# EAGLE design Pi_grammer_MAIN (EAGLE 6.5.0)
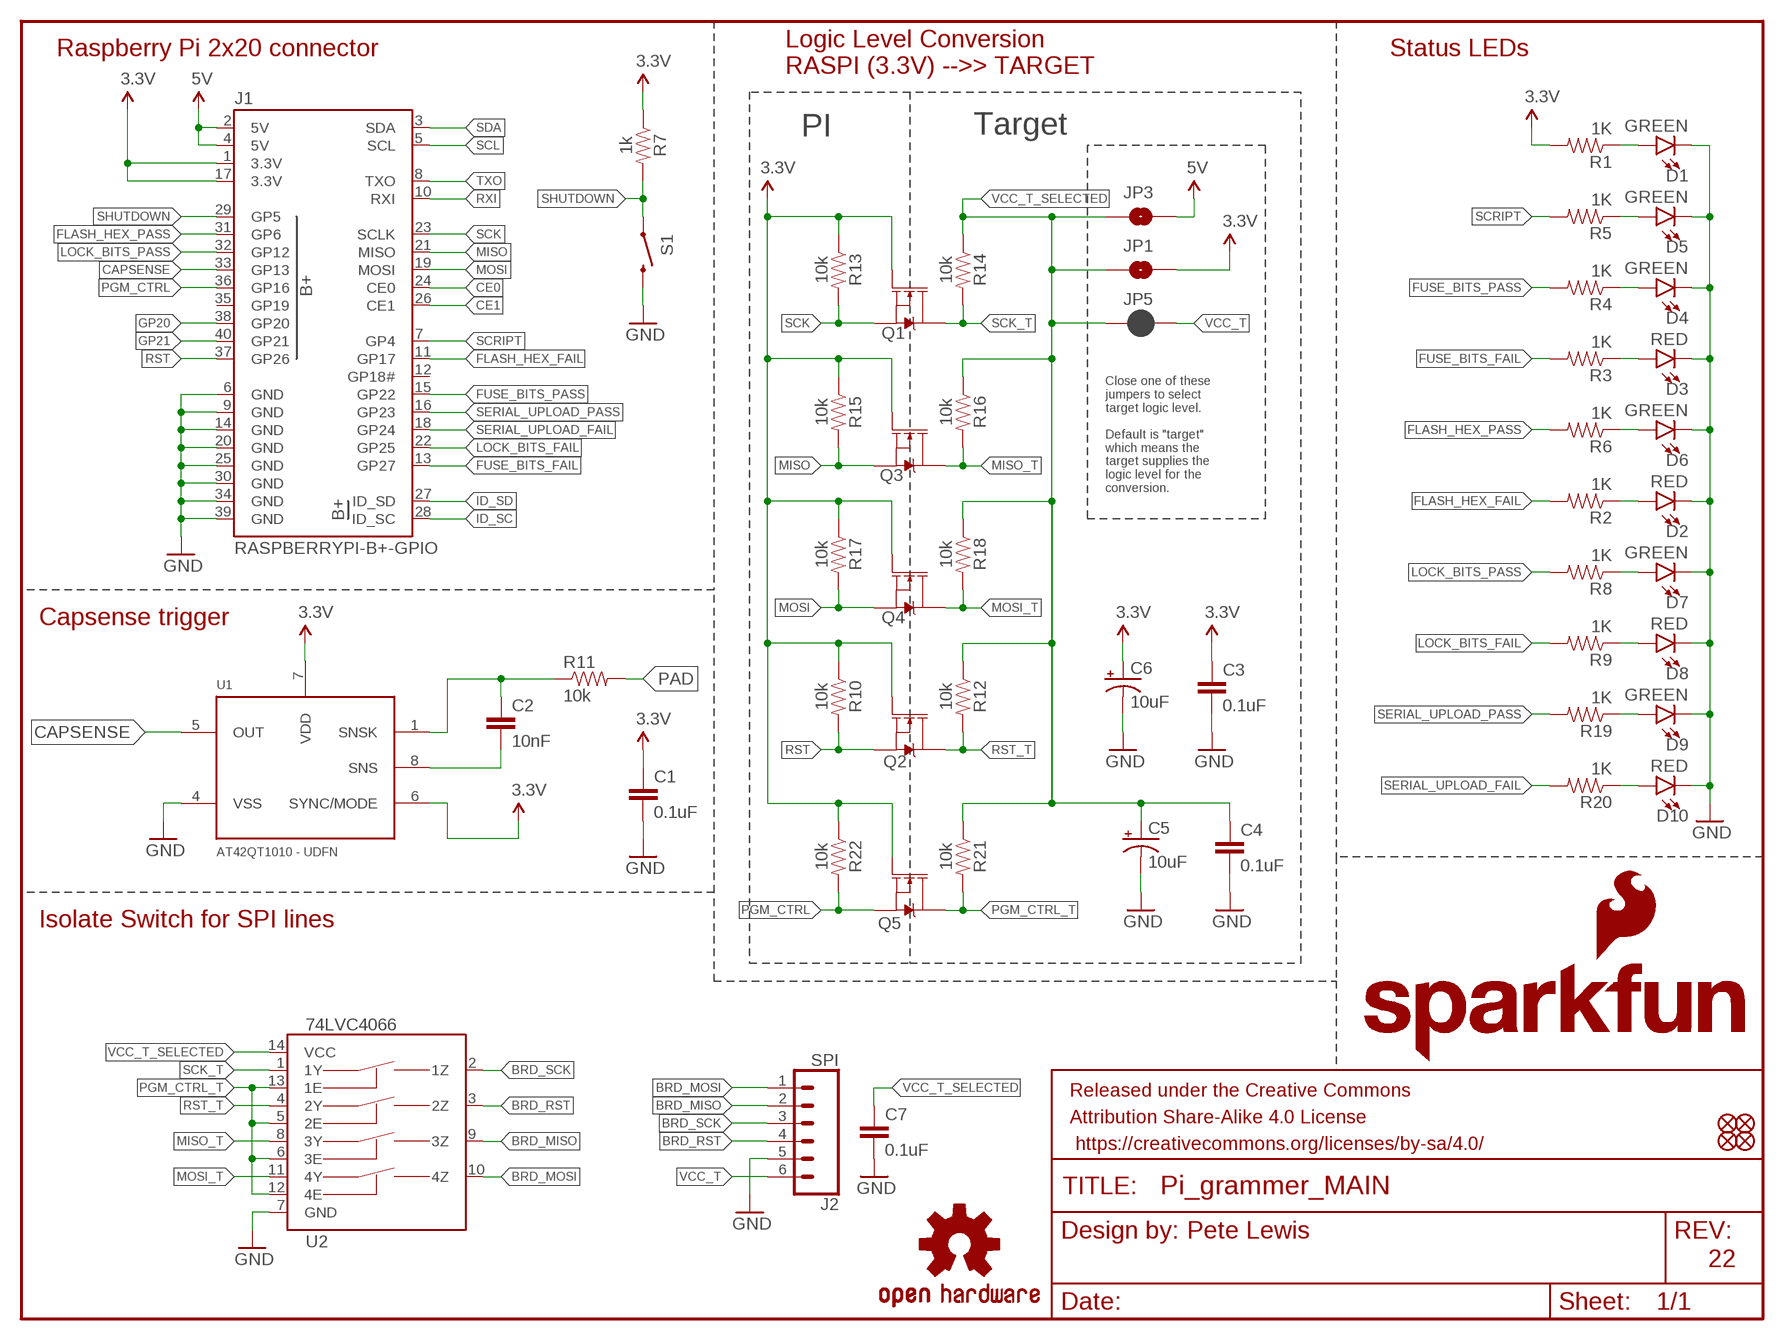
[diagram p0: schematic, sheet 1]

## Parts
C1  0.1uF  0.1UF-25V(+80/-20%)(0603)  [0603-CAP]
C2  10nF  10NF/10000PF-50V-10%(0603)  [0603-CAP]
C3  0.1uF  0.1UF-0603-25V-(+80/-20%)  [0603]
C4  0.1uF  0.1UF-0603-25V-(+80/-20%)  [0603]
C5  10uF  10UF-POLAR-EIA3216-16V-10%(TANT)  [EIA3216]
C6  10uF  10UF-POLAR-EIA3216-16V-10%(TANT)  [EIA3216]
C7  0.1uF  0.1UF-0603-25V-(+80/-20%)  [0603]
D1  GREEN  LED-GREEN1206  [LED-1206]
D2  RED  LED-RED1206  [LED-1206]
D3  RED  LED-RED1206  [LED-1206]
D4  GREEN  LED-GREEN1206  [LED-1206]
D5  GREEN  LED-GREEN1206  [LED-1206]
D6  GREEN  LED-GREEN1206  [LED-1206]
D7  GREEN  LED-GREEN1206  [LED-1206]
D8  RED  LED-RED1206  [LED-1206]
D9  GREEN  LED-GREEN1206  [LED-1206]
D10  RED  LED-RED1206  [LED-1206]
FD1  FIDUCIALUFIDUCIAL  [FIDUCIAL-MICRO]
FD2  FIDUCIALUFIDUCIAL  [FIDUCIAL-MICRO]
FD3  FIDUCIALUFIDUCIAL  [FIDUCIAL-MICRO]
FD4  FIDUCIALUFIDUCIAL  [FIDUCIAL-MICRO]
FRAME1  FRAME-LETTER  [CREATIVE_COMMONS]
J1  RASPBERRYPI-B+-GPIO  [2X20-SHROUDED]
J2  SPI  CONN_06SMD  [1X06-SMD_RA_MALE]
JP1  JUMPER-SMT_2_NO_SILK  [SMT-JUMPER_2_NO_SILK]
JP3  JUMPER-SMT_2_NO_SILK  [SMT-JUMPER_2_NO_SILK]
JP5  JUMPER-SMT_2_NC_PASTE_SILK  [SMT-JUMPER_2_NC_PASTE_SILK]
LOGO1  SFE_LOGO_FLAME.2_INCH  [SFE_LOGO_FLAME_.2]
LOGO2  OSHW-LOGOL  [OSHW-LOGO-L]
LOGO3  SFE_LOGO_NAME.6_INCH  [SFE_LOGO_NAME_.6]
Q1  220mA/50V/3.5Ω  MOSFET-NCH-BSS138  [SOT23-3]
Q2  220mA/50V/3.5Ω  MOSFET-NCH-BSS138  [SOT23-3]
Q3  220mA/50V/3.5Ω  MOSFET-NCH-BSS138  [SOT23-3]
Q4  220mA/50V/3.5Ω  MOSFET-NCH-BSS138  [SOT23-3]
Q5  220mA/50V/3.5Ω  MOSFET-NCH-BSS138  [SOT23-3]
R1  1K  1KOHM-1/10W-1%(0603)  [0603-RES]
R2  1K  1KOHM-1/10W-1%(0603)  [0603-RES]
R3  1K  1KOHM-1/10W-1%(0603)  [0603-RES]
R4  1K  1KOHM-1/10W-1%(0603)  [0603-RES]
R5  1K  1KOHM-1/10W-1%(0603)  [0603-RES]
R6  1K  1KOHM-1/10W-1%(0603)  [0603-RES]
R7  1k  1KOHM-0603-1/10W-1%  [0603]
R8  1K  1KOHM-1/10W-1%(0603)  [0603-RES]
R9  1K  1KOHM-1/10W-1%(0603)  [0603-RES]
R10  10k  10KOHM-0603-1/10W-1%  [0603]
R11  10k  10KOHM-1/10W-1%(0603)0603  [0603-RES]
R12  10k  10KOHM-0603-1/10W-1%  [0603]
R13  10k  10KOHM-0603-1/10W-1%  [0603]
R14  10k  10KOHM-0603-1/10W-1%  [0603]
R15  10k  10KOHM-0603-1/10W-1%  [0603]
R16  10k  10KOHM-0603-1/10W-1%  [0603]
R17  10k  10KOHM-0603-1/10W-1%  [0603]
R18  10k  10KOHM-0603-1/10W-1%  [0603]
R19  1K  1KOHM-1/10W-1%(0603)  [0603-RES]
R20  1K  1KOHM-1/10W-1%(0603)  [0603-RES]
R21  10k  10KOHM-0603-1/10W-1%  [0603]
R22  10k  10KOHM-0603-1/10W-1%  [0603]
S1  SWITCH-MOMENTARY-2SMD  [TACTILE-SWITCH-SMD]
U1  AT42QT1010 - UDFN  AT42QT1010UDFN  [UDFN/USON_8_PAD]
U2  74LVC4066  74LVC4066D_QUAD_BILATERAL_SWITCH  [SO14]

## Nets
3.3V: C1.1 C3.1 C6.+ J1.1(3.3V) J1.17(3.3V) JP1.2 Q1.1(G) Q2.1(G) Q3.1(G) Q4.1(G) Q5.1(G) R1.2 R7.1 R10.1 R13.1 R15.1 R17.1 R22.1 U1.6(SYNC/MODE) U1.7(VDD)
5V: J1.2(5V) J1.4(5V) JP3.2
BRD_MISO: J2.2 U2.9(3Z)
BRD_MOSI: J2.1 U2.10(4Z)
BRD_RST: J2.4 U2.3(2Z)
BRD_SCK: J2.3 U2.2(1Z)
CAPSENSE: J1.33(GP13) U1.5(OUT)
CE0: J1.24(CE0)
CE1: J1.26(CE1)
FLASH_HEX_FAIL: J1.11(GP17) R2.2
FLASH_HEX_PASS: J1.31(GP6) R6.2
FUSE_BITS_FAIL: J1.13(GP27) R3.2
FUSE_BITS_PASS: J1.15(GP22) R4.2
GND: C1.2 C3.2 C4.2 C5.- C6.- C7.2 D1.C D2.C D3.C D4.C D5.C D6.C D7.C D8.C D9.C D10.C J1.6(GND) J1.9(GND) J1.14(GND) J1.20(GND) J1.25(GND) J1.30(GND) J1.34(GND) J1.39(GND) J2.5 S1.3 U1.4(VSS) U2.7(GND)
GP20: J1.38(GP20)
GP21: J1.40(GP21)
ID_SC: J1.28(ID_SC)
ID_SD: J1.27(ID_SD)
LOCK_BITS_FAIL: J1.22(GP25) R9.2
LOCK_BITS_PASS: J1.32(GP12) R8.2
MISO: J1.21(MISO) Q3.2(S) R15.2
MISO_T: Q3.3(D) R16.2 U2.8(3Y)
MOSI: J1.19(MOSI) Q4.2(S) R17.2
MOSI_T: Q4.3(D) R18.2 U2.11(4Y)
N$1: D6.A R6.1
N$2: D1.A R1.1
N$3: D2.A R2.1
N$4: D3.A R3.1
N$5: D7.A R8.1
N$6: D4.A R4.1
N$7: D5.A R5.1
N$8: D8.A R9.1
N$10: C2.2 U1.8(SNS)
N$11: C2.1 R11.1 U1.1(SNSK)
N$13: D9.A R19.1
N$14: D10.A R20.1
PAD: R11.2
PGM_CTRL: J1.36(GP16) Q5.2(S) R22.2
PGM_CTRL_T: Q5.3(D) R21.2 U2.5(2E) U2.6(3E) U2.12(4E) U2.13(1E)
RST: J1.37(GP26) Q2.2(S) R10.2
RST_T: Q2.3(D) R12.2 U2.4(2Y)
RXI: J1.10(RXI)
SCK: J1.23(SCLK) Q1.2(S) R13.2
SCK_T: Q1.3(D) R14.2 U2.1(1Y)
SCL: J1.5(SCL)
SCRIPT: J1.7(GP4) R5.2
SDA: J1.3(SDA)
SERIAL_UPLOAD_FAIL: J1.18(GP24) R20.2
SERIAL_UPLOAD_PASS: J1.16(GP23) R19.2
SHUTDOWN: J1.29(GP5) R7.2 S1.1
TXO: J1.8(TXO)
VCC_T: J2.6 JP5.2
VCC_T_SELECTED: C4.1 C5.+ C7.1 JP1.1 JP3.1 JP5.1 R12.1 R14.1 R16.1 R18.1 R21.1 U2.14(VCC)
Unconnected: J1.12(GP18#) J1.35(GP19)

## Notes on the sheet
- Raspberry Pi 2x20 connector | Status LEDs
- Logic Level Conversion
  RASPI (3.3V) -->> TARGET
- PI | Target
- Close one of these 
  jumpers to select 
  target logic level. 
  
  Default is "target"
  which means the 
  target supplies the 
  logic level for the 
  conversion.
- Capsense trigger
- Isolate Switch for SPI lines
- Pete Lewis
- 22

## Library data of the parts
C1 = SparkFun-Capacitors:0.1UF-25V(+80/-20%)(0603): CAP-00810 Ceramic Standard decoupling cap; PROD_ID: CAP-00810
C2 = SparkFun-Capacitors:10NF/10000PF-50V-10%(0603): CAP-00867; PROD_ID: CAP-00867
C3 C4 C7 = SparkFun-Capacitors:0.1UF: 0.1µF ceramic capacitors A capacitor is a passive two-terminal electrical component used to store electrical energy temporarily in an electric field.; PROD_ID: CAP-00810
C5 C6 = SparkFun-Capacitors:10UF-POLAR: 10.0µF polarized capacitors A capacitor is a passive two-terminal electrical component used to store electrical energy temporarily in an electric field.; PROD_ID: CAP-00811
D1 D4-D7 D9 = SparkFun-LED:LED-GREEN: Green SMD LED Used in manufacturing of various products at SparkFun Packages: 0603 - SMD 0603 package [Product Link] <http://www.futureelectronics.com/en/technologies/semiconductors/optoelectronics/leds/Pages/9894312-LTST-C190GKT.aspx?CrossPart=HSMG-C190&IM=0> LilyPad 1206 - SMD1206 LilyPad package [Product Link] <http://www.futureelectronics.com/en/Technologies/Product.aspx?ProductID=IN150NGHARVATEKCORPORATION2049943&IM=0> 1206 - SMD1206 package [Product Link] <http://www.futureelectronics.com/en/technologies/semiconductors/optoelectronics/leds/Pages/8315665-LTST-C150KGKT.aspx?IM=0> 1206 Bottom Mount -SMD 1206 Bottom Mount [Product Link] <http://www.digikey.com/product-detail/en/lite-on-inc/LTST-C230KGKT/160-1456-1-ND/386854> SparkFun Products: Pro Mini 328 -5V <https://www.sparkfun.com/products/821> RedBoard <https://www.sparkfun.com/products/12757> MP3 Trigger <https://www.sparkfun.com/products/13720> Makey Makey <https://www.sparkfun.com/products/11076>; PROD_ID: DIO-00862
D2 D3 D8 D10 = SparkFun-LED:LED-RED: Red SMD LED Used in manufacturing of most products at SparkFun Packages: 0603 - SMD 0603 package [Product Link] <http://docs.avagotech.com/docs/AV02-0551EN> 0603 SMART - SMD 0603 SMART package ( more efficient and expensive)[Product Link] <http://www.osram-os.com/Graphics/XPic2/00077099_0.pdf> 1206 - SMD1206 package [Product Link] <https://www.sparkfun.com/datasheets/DevTools/LilyPad/Q150OVS4.pdff> SparkFun Products: Pro Mini 328 -5V <https://www.sparkfun.com/products/821> RedBoard <https://www.sparkfun.com/products/12757> IOIO-OTG <https://www.sparkfun.com/products/13613>; PROD_ID: DIO-09912
FD1-FD4 = SparkFun-Aesthetics:FIDUCIAL: Fiducial Alignment Points Point-of-reference for pick-and-place machines and other optical instruments.
FRAME1 = SparkFun-Aesthetics:FRAME-LETTER: Schematic Frame - Letter Standard 8.5x11 US Letter frame
J1 = SparkFun-Boards:RASPBERRYPI-B+-GPIO: Raspberry Pi B+ GPIO Header 2x20 pin connector; PROD_ID: CONN-13502
J2 = SparkFun-Connectors:CONN_06: Multi connection point. Often used as Generic Header-pin footprint for 0.1 inch spaced/style header connections On any of the 0.1 inch spaced packages, you can populate with these: Break Away Headers - Straight <https://www.sparkfun.com/products/116> (PRT-00116) Break Away Male Headers - Right Angle <https://www.sparkfun.com/products/553> (PRT-00553) Female Headers <https://www.sparkfun.com/products/115> (PRT-00115) Break Away Headers - Machine Pin <https://www.sparkfun.com/products/117> (PRT-00117) Break Away Female Headers - Swiss Machine Pin <https://www.sparkfun.com/products/743> (PRT-00743) Arduino Stackable Header - 6 Pin <https://www.sparkfun.com/products/9280> (PRT-09280) For SCREWTERMINALS and SPRING TERMINALS visit here: Screw Terimnals on SparkFun.com <https://www.sparkfun.com/search/results?term=Screw+Terminals> (5mm/3.5mm/2.54mm spacing) This device is also useful as a general connection point to wire up your design to another part of your project. Our various solder wires solder well into these plated through hole pads. Hook-Up Wire - Assortment (Stranded, 22 AWG) <https://www.sparkfun.com/products/11375> (PRT-11375) Hook-Up Wire - Assortment (Solid Core, 22 AWG) <https://www.sparkfun.com/products/11367> (PRT-11367) View the entire wire category on our website here <https://www.sparkfun.com/categories/141>; PROD_ID: CONN-08971; VALUE: RA 6Pin SMD
JP1 JP3 = SparkFun-Jumpers:JUMPER-SMT_2_NO: Normally open jumper This jumper has two pads in close proximity to each other. Apply solder to close the connection. Round pads are easier to solder for beginners, but are a lot larger. SparkFun Product that uses the round pads: SparkFun EL Sequencer <https://www.sparkfun.com/products/12781>
JP5 = SparkFun-Jumpers:JUMPER-SMT_2_NC_PASTE: Normally closed solder jumper This jumper has an aperture in the stencil to allow solder paste to bridge the split in the wire so it's normally closed (NC). Wick off the solder to open the connection. Reapply solder to reclose the connection.
LOGO1 = SparkFun-Aesthetics:SFE_LOGO_FLAME: SparkFun Flame Logo This is the SparkFun flame logo. The logo on the schematic will always be the same size; the package variant is the height of the flame. Default layer for the logo on the board is tSilk.
LOGO2 = SparkFun-Aesthetics:OSHW-LOGO: Open-Source Hardware (OSHW) Logo This logo indicates the piece of hardware it is found on incorporates a OSHW license and/or adheres to the definition of open source hardware found here: http://freedomdefined.org/OSHW
LOGO3 = SparkFun-Aesthetics:SFE_LOGO_NAME: SparkFun Font Logo This is the SparkFun name logo. The logo on the schematic will always be the same size; the package variant is the height of the flame part of the logo (or the height the flame would be, if it were drawn). Default layer for the logo on the board is tSilk.
Q1-Q5 = SparkFun-DiscreteSemi:MOSFET-NCH: N-channel MOSFETs Voltage controlled devices that allow control of high current outputs. SparkFun Products: SparkFun OpenScale <https://www.sparkfun.com/products/13261> SparkFun Digital Sandbox <https://www.sparkfun.com/products/12651> SparkFun Monster Moto Shield <https://www.sparkfun.com/products/10182> SparkFun MOSFET Power Controller <https://www.sparkfun.com/products/11214>; PROD_ID: TRANS-00830
R1-R6 R8 R9 R19 R20 = SparkFun-Resistors:1KOHM-1/10W-1%(0603): RES-07856; PROD_ID: RES-07856
R7 = SparkFun-Resistors:1KOHM: 1kΩ resistor A resistor is a passive two-terminal electrical component that implements electrical resistance as a circuit element. Resistors act to reduce current flow, and, at the same time, act to lower voltage levels within circuits. - Wikipedia; PROD_ID: RES-07856
R10 R12-R18 R21 R22 = SparkFun-Resistors:10KOHM: 10kΩ resistor A resistor is a passive two-terminal electrical component that implements electrical resistance as a circuit element. Resistors act to reduce current flow, and, at the same time, act to lower voltage levels within circuits. - Wikipedia; PROD_ID: RES-00824
R11 = SparkFun-Resistors:10KOHM-1/10W-1%(0603): RES-00824; PROD_ID: RES-00824; VALUE: 10K
S1 = SparkFun-Electromechanical:SWITCH-MOMENTARY-2: Various NO switches- pushbuttons, reed, etc; PROD_ID: SWCH-08247
U1 = SparkFun-Sensors:AT42QT1010: Atmel AT42QT1010 The AT42QT1010 (QT1010) is a digital burst mode charge-transfer (QT™) sensor that is capable of detecting nearproximityor touch, making it ideal for implementing touch controls.The QT1010 is designed specifically for human interfaces, like control panels, appliances, toys, lighting controls, or anywhere a mechanical switch or button may be found. It includes all hardware and signal processing functions necessary to provide stable sensing under a wide variety of changing conditions. Only a single low-cost capacitor is required for operation. Datasheet <http://www.atmel.com/images/Atmel-9541-AT42-QTouch-BSW-AT42QT1010_Datasheet.pdf> Sparkfun Products Sparkfun Capacitive Touch Breakout <https://www.sparkfun.com/products/12041> (SEN-12041); PROD_ID: IC-13773
U2 = SparkFun-IC-Logic:74LVC4066D_QUAD_BILATERAL_SWITCH: Nexperia Quad Bilateral Switch The 74LVC4066 is a high-speed Si-gate CMOS device. The 74LVC4066 provides four single pole, single-throw analog switch functions. Each switch has two input/output terminals (nY and nZ) and an active HIGH enable input (nE). When nE is LOW, the analog switch is turned off. Schmitt-trigger action at the enable inputs makes the circuit tolerant of slower input rise and fall times across the entire VCC range from 1.65 V to 5.5 V. Datasheet <https://assets.nexperia.com/documents/data-sheet/74LVC4066.pdf>; PROD_ID: IC-13944

## Net classes
3 VCC: width 0.381 mm, drill 0.508 mm, clearance 0.254 mm to class 0

## Board
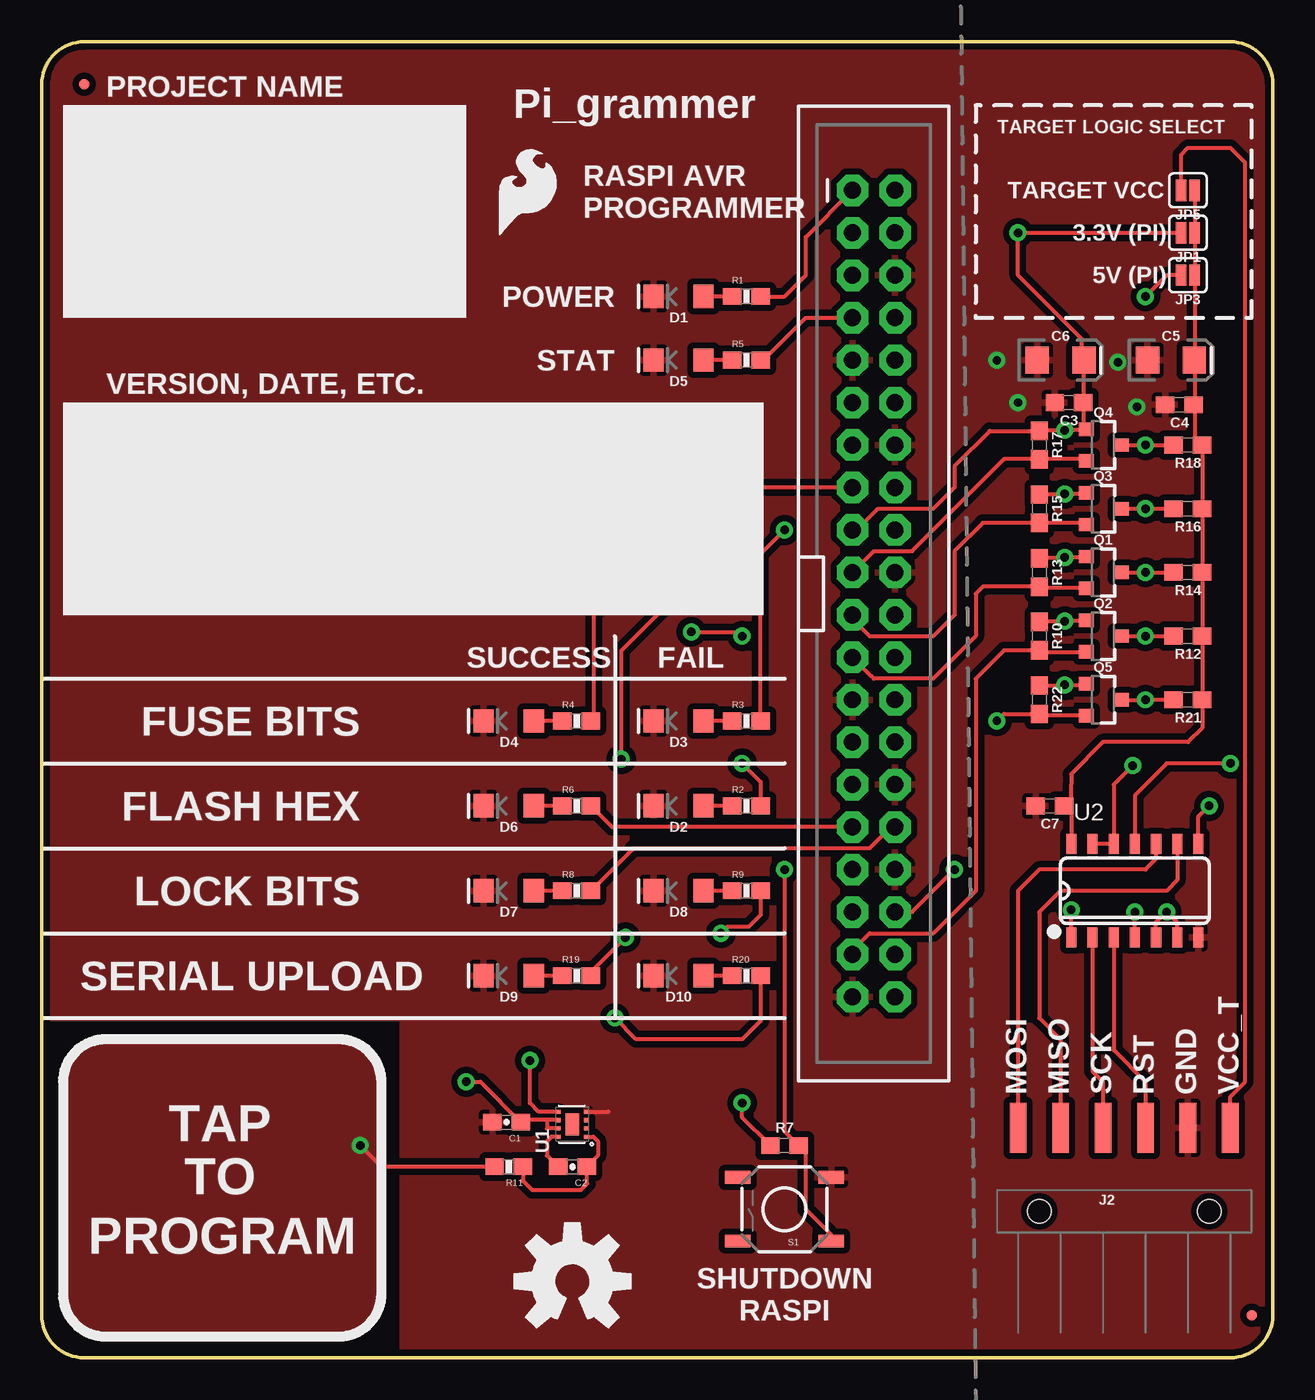
[diagram p1: board, top side]
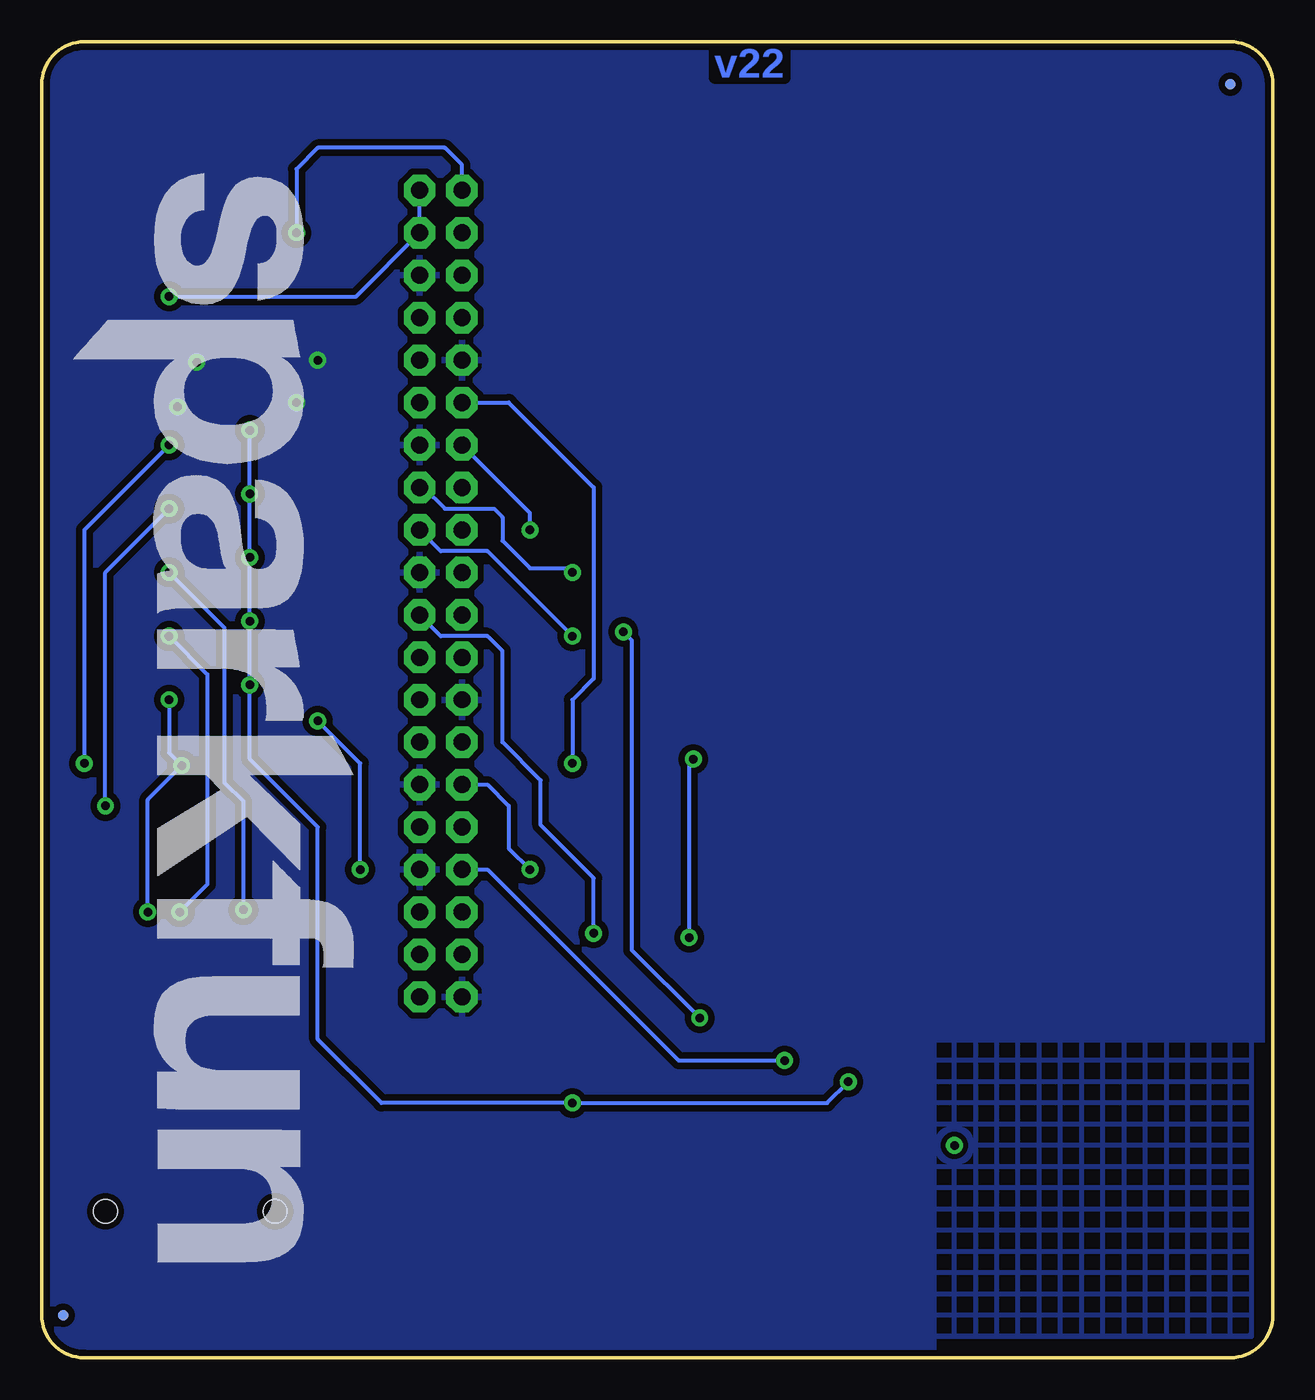
[diagram p2: board, bottom side, seen from below]

Size 73.66 x 78.74 mm. Coordinates in mm from the lower left corner, seen from the top.
Outline: 73.66,76.2 arc90 71.12,78.74 2.54,78.74 arc90 0,76.2 0,2.54 arc90 2.54,0 71.12,0 arc90 73.66,2.54 73.66,76.2
Copper layers (1*16): Top 0.035mm / dielectric 1.5mm / Bottom 0.035mm
Design rules "SparkFun-2-layer *": minimum track width 10mil, minimum drill 20mil, track to track 8mil, track to pad 8mil, pad to pad 8mil, via to via 8mil, smd to smd 8mil, copper to edge 8mil, drill to drill 8mil, minimum pad ring 12mil, minimum via ring 10mil, stop-mask expansion 4mil, vias tented up to drill 20mil, thermal gap 10mil

### Footprints (pad centres in the part's own frame; a part is rotated, then mirrored left to right if it is on the bottom)
0603-CAP = smd 1.1 x 1: 1 -0.85,0; 2 0.85,0
0603 = smd 1.1 x 1: 1 -0.85,0; 2 0.85,0
EIA3216 = smd 1.4 x 1.6: + 1.4,0; - -1.4,0
LED-1206 = smd 1.2 x 1.4: A -1.5,0; C 1.5,0
FIDUCIAL-MICRO = smd 0.635 x 0.635: 1 0,0
2X20-SHROUDED = drill 1.016 pad 1.88 octagon: 1 -1.27,24.13; 2 1.27,24.13; 3 -1.27,21.59; 4 1.27,21.59; 5 -1.27,19.05; 6 1.27,19.05; 7 -1.27,16.51; 8 1.27,16.51; 9 -1.27,13.97; 10 1.27,13.97; 11 -1.27,11.43; 12 1.27,11.43; 13 -1.27,8.89; 14 1.27,8.89; 15 -1.27,6.35; 16 1.27,6.35; 17 -1.27,3.81; 18 1.27,3.81; 19 -1.27,1.27; 20 1.27,1.27; 21 -1.27,-1.27; 22 1.27,-1.27; 23 -1.27,-3.81; 24 1.27,-3.81; 25 -1.27,-6.35; 26 1.27,-6.35; 27 -1.27,-8.89; 28 1.27,-8.89; 29 -1.27,-11.43; 30 1.27,-11.43; 31 -1.27,-13.97; 32 1.27,-13.97; 33 -1.27,-16.51; 34 1.27,-16.51; 35 -1.27,-19.05; 36 1.27,-19.05; 37 -1.27,-21.59; 38 1.27,-21.59; 39 -1.27,-24.13; 40 1.27,-24.13
1X06-SMD_RA_MALE = smd 1 x 3: 1 -6.35,5; 2 -3.81,5; 3 -1.27,5; 4 1.27,5; 5 3.81,5; 6 6.35,5 | hole 1.4: -5.08,0; 5.08,0
SMT-JUMPER_2_NO_SILK = smd 0.635 x 1.27: 1 -0.406,0; 2 0.406,0
SMT-JUMPER_2_NC_PASTE_SILK = smd 0.635 x 1.27: 1 -0.406,0; 2 0.406,0
SOT23-3 = smd 0.8 x 0.9: 1 -0.95,-1; 2 0.95,-1; 3 0,1.1
0603-RES = smd 1.1 x 1: 1 -0.85,0; 2 0.85,0
TACTILE-SWITCH-SMD = smd 1.524 x 0.762: 1 -2.794,1.905; 2 2.794,1.905; 3 -2.794,-1.905; 4 2.794,-1.905
UDFN/USON_8_PAD = smd 0.25 x 0.3: 1 -0.75,-0.852; 2 -0.25,-0.852; 3 0.25,-0.852; 4 0.75,-0.852; 5 0.75,0.852; 6 0.25,0.852; 7 -0.25,0.852; 8 -0.75,0.852 | smd 1.3 x 0.8: P$1 0,0
SO14 = smd 0.6 x 1.2: 1 -3.175,-2.8; 2 -1.905,-2.8; 3 -0.635,-2.8; 4 0.635,-2.8; 5 1.905,-2.8; 6 3.175,-2.8; 7 4.445,-2.8; 8 4.445,2.8; 9 3.175,2.8; 10 1.905,2.8; 11 0.635,2.8; 12 -0.635,2.8; 13 -1.905,2.8; 14 -3.175,2.8

### Placement (x,y rotation side)
C1  27.81,14.1 180 top
C2  31.75,11.43 180 top
C3  61.47,57.15 180 top
C4  68.07,57.02 180 top
C5  67.56,59.69 0 top
C6  60.96,59.69 0 top
C7  60.33,33.02 180 top
D1  38.1,63.5 180 top
D2  38.1,33.02 180 top
D3  38.1,38.1 180 top
D4  27.94,38.1 180 top
D5  38.1,59.69 180 top
D6  27.94,33.02 180 top
D7  27.94,27.94 180 top
D8  38.1,27.94 180 top
D9  27.94,22.86 180 top
D10  38.1,22.86 180 top
FD1  2.54,76.2 0 top
FD2  72.39,2.54 0 top
FD3  72.39,2.54 0 bottom
FD4  2.54,76.2 0 bottom
FRAME1  3.47,-12.7 0 top  (outside the outline)
J1  49.78,45.72 0 top
J2  64.77,8.76 0 top
JP1  68.58,67.31 180 top
JP3  68.58,64.77 180 top
JP5  68.58,69.85 180 top
LOGO1  27.05,66.93 0 top
LOGO2  31.75,4.57 0 top
LOGO3  71.75,70.87 270 bottom
Q1  63.5,46.99 270 top
Q2  63.5,43.18 270 top
Q3  63.5,50.8 270 top
Q4  63.5,54.61 270 top
Q5  63.5,39.37 270 top
R1  42.16,63.5 0 top
R2  42.16,33.02 0 top
R3  42.16,38.1 0 top
R4  32,38.1 0 top
R5  42.16,59.69 0 top
R6  32,33.02 0 top
R7  44.45,12.7 0 top
R8  32,27.94 0 top
R9  42.16,27.94 0 top
R10  59.69,43.18 270 top
R11  27.94,11.43 180 top
R12  68.58,43.18 180 top
R13  59.69,46.99 270 top
R14  68.58,46.99 180 top
R15  59.69,50.8 270 top
R16  68.58,50.8 180 top
R17  59.69,54.61 270 top
R18  68.58,54.61 180 top
R19  32,22.86 0 top
R20  42.16,22.86 0 top
R21  68.58,39.37 180 top
R22  59.69,39.37 270 top
S1  44.45,8.89 180 top
U1  31.75,13.97 90 top
U2  64.77,27.94 0 top

### Tracks (layer width: path | path; a pad name or v marks a point on that pad's centre or on a via)
3.3V  (via drill 0.51)
  Top 0.254: U1.7 30.23,13.72 30.23,14.22 | 30.23,14.22 28.66,14.22 C1.1 26.25,16.51 v25.4,16.51 | U1.6 30.23,14.22 | R1.2 44.45,63.5 45.72,64.77 45.72,67.06 J1.1 | J1.17 48.77,49.53 50.04,50.8 53.34,50.8 54.61,52.07 54.61,53.34 56.73,55.46 R17.1 59.79,55.56 59.85,55.5 v61.21,55.5 62.16,55.5 62.36,55.7 | Q4.1 62.36,55.7 | 62.36,55.7 62.36,57.15 | 62.36,57.15 C6.+ 62.23,59.82 62.23,60.96 58.42,64.77 v58.42,67.31 JP1.2 | C3.1 62.36,57.15 | R10.1 59.79,44.13 59.85,44.07 v61.21,44.07 62.44,44.07 Q2.1 | Q3.1 62.4,51.65 62.36,51.69 v61.21,51.69 59.73,51.69 R15.1 | R13.1 59.79,47.94 59.85,47.88 v61.21,47.88 62.44,47.88 Q1.1 | R7.1 41.91,14.39 v41.91,15.24 | Q5.1 62.4,40.22 61.25,40.22 v61.21,40.26 61.17,40.22 R22.1
  Bottom 0.254: v61.21,55.5 v61.21,51.69 v61.21,47.88 v61.21,44.07 v61.21,40.26 61.21,35.81 57.15,31.75 57.15,19.05 53.34,15.24 v41.91,15.24 26.67,15.24 v25.4,16.51 | J1.1 48.51,71.37 49.53,72.39 57.15,72.39 58.42,71.12 v58.42,67.31
5V  (via drill 0.51)
  Top 0.254: JP3.2 67.31,64.77 v66.04,63.5
  Bottom 0.254: v66.04,63.5 54.86,63.5 J1.4 J1.2
BRD_MISO
  Top 0.254: U2.9 67.94,28.57 67.31,27.94 60.96,27.94 59.69,26.67 59.69,20.32 60.96,19.05 J2.2
BRD_MOSI
  Top 0.254: U2.10 66.67,29.84 66.04,29.21 59.69,29.21 58.42,27.94 J2.1
BRD_RST
  Top 0.254: U2.3 64.14,18.41 66.04,16.51 J2.4
BRD_SCK
  Top 0.254: U2.2 62.87,17.14 63.5,16.51 J2.3
CAPSENSE  (via drill 0.51)
  Top 0.254: U1.5 29.73,14.72 29.21,15.24 v29.21,17.78
  Bottom 0.254: J1.33 46.99,29.21 35.56,17.78 v29.21,17.78
FLASH_HEX_FAIL  (via drill 0.51)
  Top 0.254: v41.91,35.56 43.01,34.46 R2.2
  Bottom 0.254: J1.11 45.72,57.15 40.64,52.07 40.64,40.64 41.91,39.37 v41.91,35.56
FLASH_HEX_PASS
  Top 0.254: J1.31 34.12,31.75 R6.2
FUSE_BITS_FAIL  (via drill 0.51)
  Top 0.254: R3.2 43.01,48.09 v44.45,49.53
  Bottom 0.254: v44.45,49.53 44.45,50.55 J1.13
FUSE_BITS_PASS
  Top 0.254: J1.15 40.64,52.07 33.02,44.45 33.02,38.27 R4.2
GND  (via drill 0.51)
  Top 0.254: U1.4 33.9,14.72 33.91,14.73
  other vias: 58.42,57.15 57.15,59.69 64.39,59.56 65.53,56.9
  pour Bottom (isolate 0.381): 0,78.74 73.66,78.74 73.66,0 20.32,0 20.32,19.05 0,19.05
  pour Top (isolate 0.381): 0,78.74 73.66,78.74 73.66,0 21.59,0 21.59,20.32 0,20.32
  pour Bottom (isolate 0.305, hatched): 20.32,1.27 1.27,1.27 1.27,19.05 20.32,19.05
LOCK_BITS_FAIL  (via drill 0.51)
  Top 0.254: R9.2 43.01,26.5 42.29,25.78 41.02,25.78 v40.64,25.4
  Bottom 0.254: v40.64,25.4 40.64,28.7 43.81,31.88 43.81,34.54 46.1,36.83 46.1,42.29 46.99,43.18 49.78,43.18 J1.22
LOCK_BITS_PASS
  Top 0.254: J1.32 50.8,31.75 49.53,30.48 35.39,30.48 R8.2
MISO
  Top 0.254: Q3.2 62.4,49.95 R15.2 56.3,49.95 54.61,48.26 54.61,44.45 53.34,43.18 49.53,43.18 48.51,44.2 J1.21
MISO_T  (via drill 0.51)
  Top 0.254: Q3.3 v66.04,50.8 R16.2 | U2.8 69.22,32.38 v69.85,33.02
  Bottom 0.254: v69.85,33.02 69.85,46.99 v66.04,50.8
MOSI
  Top 0.254: Q4.2 62.4,53.76 R17.2 57.57,53.76 52.07,48.26 49.78,48.26 J1.19
MOSI_T  (via drill 0.51)
  Top 0.254: Q4.3 v66.04,54.61 R18.2 | v71.12,35.56 67.31,35.56 65.41,33.66 U2.11
  Bottom 0.254: v66.04,54.61 71.12,49.53 v71.12,35.56
N$1
  Top 0.254: R6.1 D6.A
N$2
  Top 0.254: R1.1 D1.A
N$3
  Top 0.254: R2.1 D2.A
N$4
  Top 0.254: R3.1 D3.A
N$5
  Top 0.254: R8.1 D7.A
N$6
  Top 0.254: R4.1 D4.A
N$7
  Top 0.254: R5.1 D5.A
N$8
  Top 0.254: R9.1 D8.A
N$10
  Top 0.254: U1.8 30.49,13.22 30.23,12.95 30.23,12.1 C2.2
N$11
  Top 0.254: R11.1 28.79,10.58 29.34,10.03 32.26,10.03 32.64,10.41 32.64,11.39 C2.1 33.27,12.1 33.27,12.95 33.01,13.22 U1.1
N$13
  Top 0.254: R19.1 D9.A
N$14
  Top 0.254: R20.1 D10.A
PAD  (via drill 0.51)
  Top 0.254: R11.2 20.32,11.43 v19.05,12.7
  pour Top (isolate 0.305): 20.32,16.51 arc90 17.78,19.05 3.81,19.05 arc90 1.27,16.51 1.27,3.81 arc90 3.81,1.27 17.78,1.27 arc90 20.32,3.81
PGM_CTRL  (via drill 0.51)
  Top 0.254: Q5.2 59.79,38.42 R22.2 57.57,38.52 v57.15,38.1 | J1.36 52.07,26.67 v54.61,29.21
  Bottom 0.254: v54.61,29.21 54.61,35.56 v57.15,38.1
PGM_CTRL_T  (via drill 0.51)
  Top 0.254: R21.2 v66.04,39.37 Q5.3 | U2.13 U2.12 64.14,34.29 v65.28,35.43 | U2.5 66.67,26.04 v67.31,26.67 67.94,26.04 U2.6
  Bottom 0.254: v66.04,39.37 66.04,36.2 v65.28,35.43 67.31,33.4 v67.31,26.67
RST
  Top 0.254: J1.37 48.51,24.38 49.53,25.4 53.34,25.4 55.88,27.94 55.88,40.64 57.57,42.33 R10.2 59.79,42.23 Q2.2
RST_T  (via drill 0.51)
  Top 0.254: R12.2 v66.04,43.18 Q2.3 | U2.4 v65.41,26.67
  Bottom 0.254: v66.04,43.18 63.75,40.89 63.75,28.32 v65.41,26.67
SCK
  Top 0.254: J1.23 49.66,40.77 49.78,40.64 53.34,40.64 55.88,43.18 55.88,45.72 56.3,46.14 R13.2 59.79,46.04 Q1.2
SCK_T  (via drill 0.51)
  Top 0.254: R14.2 v66.04,46.99 Q1.3 | U2.1 v61.59,26.8
  Bottom 0.254: v66.04,46.99 62.74,43.69 62.74,34.42 61.59,33.27 v61.59,26.8
SCRIPT
  Top 0.254: R5.2 43.18,59.69 45.72,62.23 J1.7
SERIAL_UPLOAD_FAIL  (via drill 0.51)
  Top 0.254: R20.2 43.01,20.15 41.91,19.05 35.56,19.05 v34.29,20.32 | v38.86,43.43 41.66,43.43 v41.91,43.18
  Bottom 0.254: v34.29,20.32 38.35,24.38 38.35,42.93 v38.86,43.43 | v41.91,43.18 46.99,48.26 49.78,48.26 J1.18
SERIAL_UPLOAD_PASS  (via drill 0.51)
  Top 0.254: v41.91,46.99 39.37,46.99 34.67,42.29 v34.67,35.81 | v34.92,25.15 32.85,23.07 R19.2
  Bottom 0.254: J1.16 50.8,52.07 49.53,50.8 46.61,50.8 46.1,50.29 46.1,48.9 44.45,47.24 42.16,47.24 v41.91,46.99 | v34.67,35.81 34.92,35.56 v34.92,25.15
SHUTDOWN  (via drill 0.51)
  Top 0.254: v44.45,29.21 44.45,13.55 R7.2 45.72,12.28 45.72,8.89 47.24,7.37 S1.1
  Bottom 0.254: J1.29 46.99,34.29 45.72,33.02 45.72,30.48 v44.45,29.21
VCC_T
  Top 0.254: JP5.2 68.17,71.98 68.58,72.39 71.12,72.39 72.01,71.5 72.01,16.51 71.12,15.62 J2.6
VCC_T_SELECTED
  Top 0.254: JP5.1 JP1.1 JP3.1 68.99,59.69 | 68.99,59.69 68.99,57.15 | 68.99,57.15 68.99,55.05 R18.1 R16.1 R14.1 R12.1 R21.1 69.43,37.68 68.58,36.83 63.5,36.83 61.59,34.92 61.59,34.29 61.59,33.44 | C5.+ 68.99,59.69 | C4.1 68.92,57.09 68.99,57.15 | 61.59,33.44 U2.14 | C7.1 61.59,33.44

### Text on the board
Bottom: v22
tPlace: PROJECT NAME | Pi_grammer | TARGET LOGIC SELECT | TARGET VCC | RASPI AVR / PROGRAMMER | 3.3V (PI) | 5V (PI) | POWER | STAT | VERSION, DATE, ETC. | SUCCESS | FAIL | FUSE BITS | FLASH HEX | LOCK BITS | SERIAL UPLOAD | MOSI | MISO | SCK | RST | GND | VCC_T | TAP | TO | PROGRAM | SHUTDOWN / RASPI
tDocu: EDGE of raspi enclosure | Pete Lewis